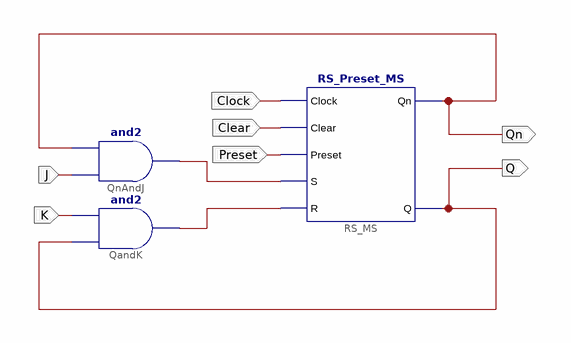
[diagram p0: schematic sheet 1]
// Xilinx ISE schematic JK_Preset_MS.sch (spartan3e) as structural Verilog: 3 symbols, 7 ports
module JK_Preset_MS (
  input  J,
  input  Clock,
  input  Clear,
  input  Preset,
  input  K,
  output Qn,
  output Q
);

  wire XLXN_20, XLXN_21;

  RS_Preset_MS RS_MS (.Clock(Clock), .Clear(Clear), .Preset(Preset), .S(XLXN_21), .R(XLXN_20), .Qn(Qn), .Q(Q));
  and QnAndJ (XLXN_21, J, Qn);
  and QandK (XLXN_20, Q, K);
endmodule
